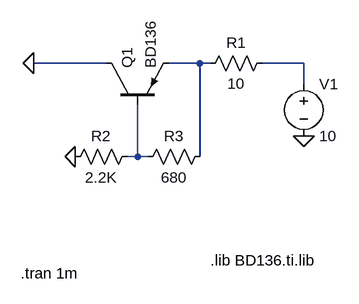
[diagram p0: schematic Draft3.asc]
Draft3.asc, the LTspice schematic file:
Version 4
SHEET 1 880 680
WIRE 192 96 80 96
WIRE 336 96 288 96
WIRE 352 96 336 96
WIRE 496 96 432 96
WIRE 496 128 496 96
WIRE 240 240 240 160
WIRE 240 240 224 240
WIRE 256 240 240 240
WIRE 336 240 336 96
FLAG 496 208 0
FLAG 80 96 0
FLAG 144 240 0
SYMBOL pnp 192 160 R270
SYMATTR InstName Q1
SYMATTR Value BD136
SYMBOL res 448 80 R90
WINDOW 0 0 56 VBottom 2
WINDOW 3 32 56 VTop 2
SYMATTR InstName R1
SYMATTR Value 10
SYMBOL res 240 224 R90
WINDOW 0 0 56 VBottom 2
WINDOW 3 32 56 VTop 2
SYMATTR InstName R2
SYMATTR Value 2.2K
SYMBOL res 352 224 R90
WINDOW 0 0 56 VBottom 2
WINDOW 3 32 56 VTop 2
SYMATTR InstName R3
SYMATTR Value 680
SYMBOL voltage 496 112 R0
WINDOW 123 0 0 Left 0
WINDOW 39 0 0 Left 0
SYMATTR InstName V1
SYMATTR Value 10
TEXT 352 400 Left 2 !.lib BD136.ti.lib
TEXT 60 420 Left 2 !.tran 1m

The netlist it stands for:
* Draft3.asc
Q1 0 N003 N001 0 BD136
R1 N002 N001 10
R2 N003 0 2.2K
R3 N001 N003 680
V1 N002 0 10
.model NPN NPN
.model PNP PNP
.lib standard.bjt
.lib BD136.ti.lib
.tran 1m
.backanno
.end